# EAGLE design pixelAdapter_f103c8 (EAGLE 9.5.2)
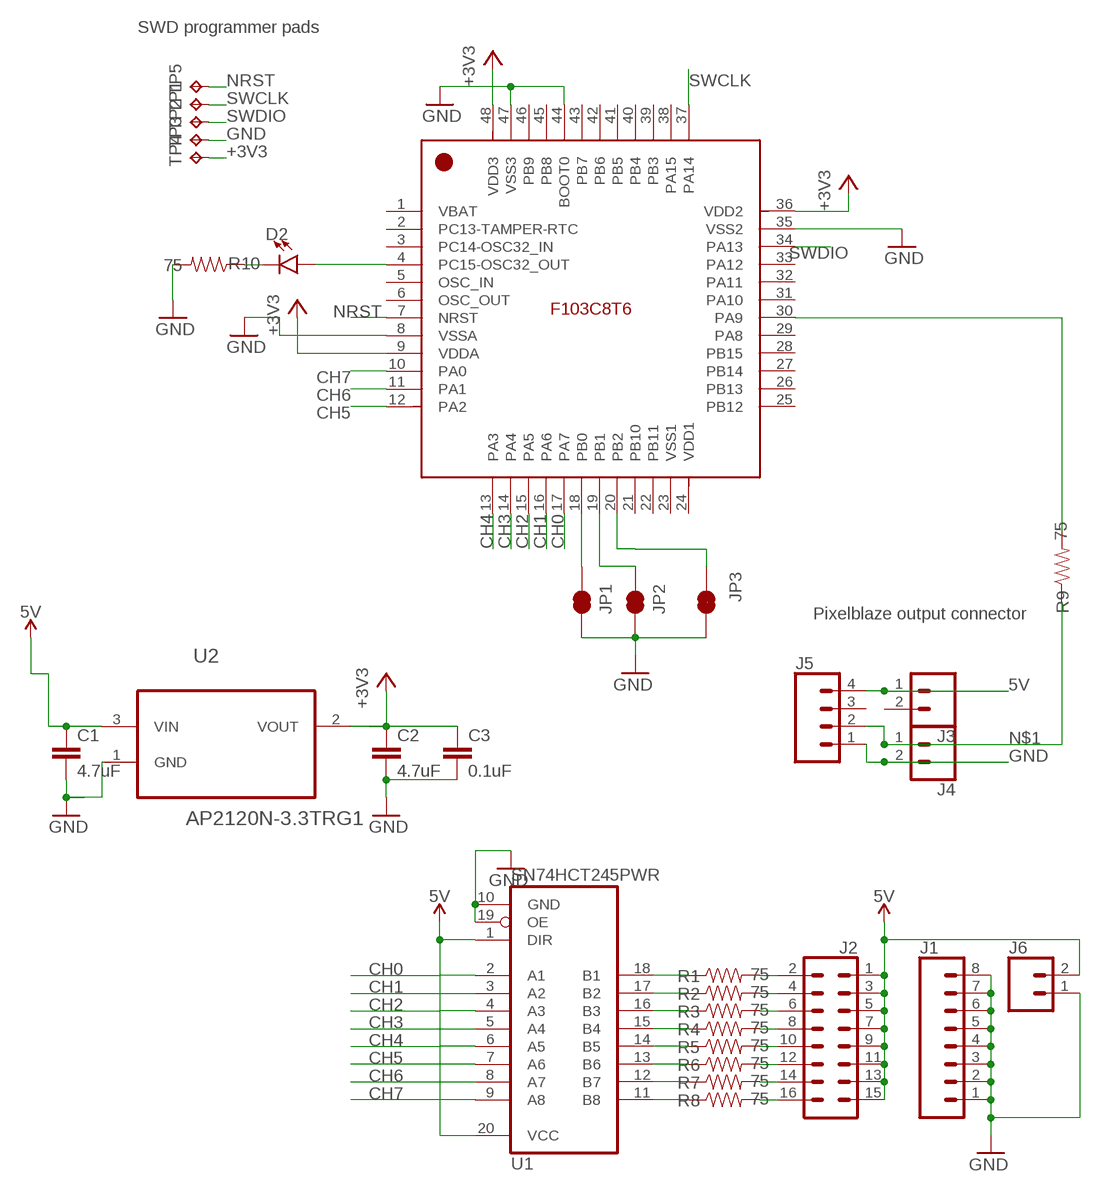
[diagram p0: schematic, sheet 1]

## Parts
C1  4.7uF  4.7UF0603  [0603]
C2  4.7uF  4.7UF0603  [0603]
C3  0.1uF  0.1UF-0603-25V-(+80/-20%)  [0603]
D2  LED0603  [LED-0603]
J1  CONN_08"  [1X08]
J2  CONN_08X2  [2X8]
J3  CONN_025MM  [SCREWTERMINAL-5MM-2]
J4  CONN_025MM  [SCREWTERMINAL-5MM-2]
J5  CONN_04LOCK  [1X04_LOCK]
J6  CONN_02  [1X02]
JP1  JUMPER-SMT_2_NC_TRACE_SILK  [SMT-JUMPER_2_NC_TRACE_SILK]
JP2  JUMPER-SMT_2_NC_TRACE_SILK  [SMT-JUMPER_2_NC_TRACE_SILK]
JP3  JUMPER-SMT_2_NC_TRACE_SILK  [SMT-JUMPER_2_NC_TRACE_SILK]
R1  75  100OHM-0603-1/4W-5%  [0603]
R2  75  100OHM-0603-1/4W-5%  [0603]
R3  75  100OHM-0603-1/4W-5%  [0603]
R4  75  100OHM-0603-1/4W-5%  [0603]
R5  75  100OHM-0603-1/4W-5%  [0603]
R6  75  100OHM-0603-1/4W-5%  [0603]
R7  75  100OHM-0603-1/4W-5%  [0603]
R8  75  100OHM-0603-1/4W-5%  [0603]
R9  75  100OHM-0603-1/4W-5%  [0603]
R10  75  100OHM-0603-1/4W-5%  [0603]
TP1  TPTP20SQ  [TP20SQ]
TP2  TPTP20SQ  [TP20SQ]
TP3  TPTP20SQ  [TP20SQ]
TP4  TPTP20SQ  [TP20SQ]
TP5  TPTP20SQ  [TP20SQ]
U1  SN74HCT245PWR  74245PW  [TSSOP20]
U2  AP2120N-3.3TRG1  MCP1700T-3302E/TT  [SOT95P237X112-3N]
U$1  STM32F103C8T6  [LQFP48_7X7MM_0.5MMPP]

## Nets
5V: C1.1 J2.1 J2.3 J2.5 J2.7 J2.9 J2.11 J2.13 J2.15 J3.1 J5.4 J6.2 U1.1(DIR) U1.20(VCC) U2.3(VIN)
+3V3: C2.1 C3.1 TP4.TP U2.2(VOUT) U$1.9(VDDA) U$1.36(VDD2) U$1.48(VDD3)
CH0: U1.2(A1) U$1.17(PA7)
CH1: U1.3(A2) U$1.16(PA6)
CH2: U1.4(A3) U$1.15(PA5)
CH3: U1.5(A4) U$1.14(PA4)
CH4: U1.6(A5) U$1.13(PA3)
CH5: U1.7(A6) U$1.12(PA2)
CH6: U1.8(A7) U$1.11(PA1)
CH7: U1.9(A8) U$1.10(PA0)
GND: C1.2 C2.2 C3.2 J1.1 J1.2 J1.3 J1.4 J1.5 J1.6 J1.7 J1.8 J4.2 J5.1 J6.1 JP1.2 JP2.2 JP3.1 R10.2 TP3.TP U1.10(GND) U1.19(OE) U2.1(GND) U$1.8(VSSA) U$1.35(VSS2) U$1.44(BOOT0) U$1.47(VSS3)
LED0: J2.2 R1.2
LED1: J2.4 R2.2
LED2: J2.6 R3.2
LED3: J2.8 R4.2
LED4: J2.10 R5.2
LED5: J2.12 R6.2
LED6: J2.14 R7.2
LED7: J2.16 R8.2
N$1: J4.1 J5.2 R9.1
N$2: JP1.1 U$1.18(PB0)
N$3: D2.A U$1.4(PC15-OSC32_OUT)
N$4: JP2.1 U$1.19(PB1)
N$5: JP3.2 U$1.20(PB2)
N$12: R1.1 U1.18(B1)
N$13: R2.1 U1.17(B2)
N$14: R3.1 U1.16(B3)
N$15: R4.1 U1.15(B4)
N$16: R5.1 U1.14(B5)
N$17: R6.1 U1.13(B6)
N$18: R7.1 U1.12(B7)
N$19: R8.1 U1.11(B8)
N$21: D2.C R10.1
NRST: TP5.TP U$1.7(NRST)
RX: R9.2 U$1.30(PA9)
SWCLK: TP1.TP U$1.37(PA14)
SWDIO: TP2.TP U$1.34(PA13)
Unconnected: J3.2 J5.3 U$1.1(VBAT) U$1.2(PC13-TAMPER-RTC) U$1.3(PC14-OSC32_IN) U$1.5(OSC_IN) U$1.6(OSC_OUT) U$1.21(PB10) U$1.22(PB11) U$1.23(VSS1) U$1.24(VDD1) U$1.25(PB12) U$1.26(PB13) U$1.27(PB14) U$1.28(PB15) U$1.29(PA8) U$1.31(PA10) U$1.32(PA11) U$1.33(PA12) U$1.38(PA15) U$1.39(PB3) U$1.40(PB4) U$1.41(PB5) U$1.42(PB6) U$1.43(PB7) U$1.45(PB8) U$1.46(PB9)

## Notes on the sheet
- SWD programmer pads
- Pixelblaze output connector

## Library data of the parts
C1 C2 = SparkFun-Capacitors:4.7UF: 4.7µF ceramic capacitors A capacitor is a passive two-terminal electrical component used to store electrical energy temporarily in an electric field.; PROD_ID: CAP-08280
C3 = SparkFun-Capacitors:0.1UF: 0.1µF ceramic capacitors A capacitor is a passive two-terminal electrical component used to store electrical energy temporarily in an electric field.; PROD_ID: CAP-00810
D2 = SparkFun-LED:LED: LED (Generic) Standard schematic elements and footprints for 5mm, 3mm, 1206, and 0603 sized LEDs. Generic LEDs with no color specified.
J1 = SparkFun-Connectors:CONN_08: Multi connection point. Often used as Generic Header-pin footprint for 0.1 inch spaced/style header connections On any of the 0.1 inch spaced packages, you can populate with these: Break Away Headers - Straight <https://www.sparkfun.com/products/116> (PRT-00116) Break Away Male Headers - Right Angle <https://www.sparkfun.com/products/553> (PRT-00553) Female Headers <https://www.sparkfun.com/products/115> (PRT-00115) Break Away Headers - Machine Pin <https://www.sparkfun.com/products/117> (PRT-00117) Break Away Female Headers - Swiss Machine Pin <https://www.sparkfun.com/products/743> (PRT-00743) Arduino Stackable Header - 8 Pin <https://www.sparkfun.com/products/9279> (PRT-09279) For SCREWTERMINALS and SPRING TERMINALS visit here: Screw Terimnals on SparkFun.com <https://www.sparkfun.com/search/results?term=Screw+Terminals> (5mm/3.5mm/2.54mm spacing) This device is also useful as a general connection point to wire up your design to another part of your project. Our various solder wires solder well into these plated through hole pads. Hook-Up Wire - Assortment (Stranded, 22 AWG) <https://www.sparkfun.com/products/11375> (PRT-11375) Hook-Up Wire - Assortment (Solid Core, 22 AWG) <https://www.sparkfun.com/products/11367> (PRT-11367) View the entire wire category on our website here <https://www.sparkfun.com/categories/141> Special notes: Molex polarized connector foot print use with SKU : PRT-08231 with associated crimp pins and housings. 1MM SMD Version SKU: PRT-10208 NOTES ON THE VARIANTS LOCK and LOCK_LONGPADS... This footprint was designed to help hold the alignment of a through-hole component (i.e. 6-pin header) while soldering it into place. You may notice that each hole has been shifted either up or down by 0.005 of an inch from it's more standard position (which is a perfectly straight line). This slight alteration caused the pins (the squares in the middle) to touch the edges of the holes. Because they are alternating, it causes a "brace" to hold the component in place. 0.005 has proven to be the perfect amount of "off-center" position when using our standard breakaway headers. Although looks a little odd when you look at the bare footprint, once you have a header in there, the alteration is very hard to notice. Also,if you push a header all the way into place, it is covered up entirely on the bottom side.; PROD_ID: CONN-08438
J2 = SparkFun-Connectors:CONN_08X2: Multi connection point. Often used as Generic Header-pin footprint for 0.1 inch spaced/style header connections You can populate with any combo of single row headers, but if you'd like an exact match, check this: Header - 2x8 (Male, 0.1") <https://www.sparkfun.com/products/13156> (PRT-13156) On any of the 0.1 inch spaced packages, you can populate with these: Break Away Headers - Straight <https://www.sparkfun.com/products/116> (PRT-00116) Break Away Male Headers - Right Angle <https://www.sparkfun.com/products/553> (PRT-00553) Female Headers <https://www.sparkfun.com/products/115> (PRT-00115) Break Away Headers - Machine Pin <https://www.sparkfun.com/products/117> (PRT-00117) Break Away Female Headers - Swiss Machine Pin <https://www.sparkfun.com/products/743> (PRT-00743)
J3 J4 = bens:CONN_02: Multi connection point. Often used as Generic Header-pin footprint for 0.1 inch spaced/style header connections On any of the 0.1 inch spaced packages, you can populate with these: Break Away Headers - Straight <https://www.sparkfun.com/products/116> (PRT-00116) Break Away Male Headers - Right Angle <https://www.sparkfun.com/products/553> (PRT-00553) Female Headers <https://www.sparkfun.com/products/115> (PRT-00115) Break Away Headers - Machine Pin <https://www.sparkfun.com/products/117> (PRT-00117) Break Away Female Headers - Swiss Machine Pin <https://www.sparkfun.com/products/743> (PRT-00743) For SCREWTERMINALS and SPRING TERMINALS visit here: Screw Terimnals on SparkFun.com <https://www.sparkfun.com/search/results?term=Screw+Terminals> (5mm/3.5mm/2.54mm spacing) This device is also useful as a general connection point to wire up your design to another part of your project. Our various solder wires solder well into these plated through hole pads. Hook-Up Wire - Assortment (Stranded, 22 AWG) <https://www.sparkfun.com/products/11375> (PRT-11375) Hook-Up Wire - Assortment (Solid Core, 22 AWG) <https://www.sparkfun.com/products/11367> (PRT-11367) View the entire wire category on our website here <https://www.sparkfun.com/categories/141> Special notes: Molex polarized connector foot print use with: PRT-08233 with associated crimp pins and housings. 2.54_SCREWTERM for use with PRT-10571. 3.5mm Screw Terminal footprints for PRT-08084 5mm Screw Terminal footprints for use with PRT-08432; SF_SKU: PRT-08432
J5 = SparkFun-Connectors:CONN_04: Multi connection point. Often used as Generic Header-pin footprint for 0.1 inch spaced/style header connections On any of the 0.1 inch spaced packages, you can populate with these: Break Away Headers - Straight <https://www.sparkfun.com/products/116> (PRT-00116) Break Away Male Headers - Right Angle <https://www.sparkfun.com/products/553> (PRT-00553) Female Headers <https://www.sparkfun.com/products/115> (PRT-00115) Break Away Headers - Machine Pin <https://www.sparkfun.com/products/117> (PRT-00117) Break Away Female Headers - Swiss Machine Pin <https://www.sparkfun.com/products/743> (PRT-00743) For SCREWTERMINALS and SPRING TERMINALS visit here: Screw Terimnals on SparkFun.com <https://www.sparkfun.com/search/results?term=Screw+Terminals> (5mm/3.5mm/2.54mm spacing) This device is also useful as a general connection point to wire up your design to another part of your project. Our various solder wires solder well into these plated through hole pads. Hook-Up Wire - Assortment (Stranded, 22 AWG) <https://www.sparkfun.com/products/11375> (PRT-11375) Hook-Up Wire - Assortment (Solid Core, 22 AWG) <https://www.sparkfun.com/products/11367> (PRT-11367) View the entire wire category on our website here <https://www.sparkfun.com/categories/141> Special notes: Molex polarized connector foot print use with SKU : PRT-08231 with associated crimp pins and housings. 1MM SMD Version SKU: PRT-10208; PROD_ID: CONN-09696
J6 = SparkFun-Connectors:CONN_02: Multi connection point. Often used as Generic Header-pin footprint for 0.1 inch spaced/style header connections On any of the 0.1 inch spaced packages, you can populate with these: Break Away Headers - Straight <https://www.sparkfun.com/products/116> (PRT-00116) Break Away Male Headers - Right Angle <https://www.sparkfun.com/products/553> (PRT-00553) Female Headers <https://www.sparkfun.com/products/115> (PRT-00115) Break Away Headers - Machine Pin <https://www.sparkfun.com/products/117> (PRT-00117) Break Away Female Headers - Swiss Machine Pin <https://www.sparkfun.com/products/743> (PRT-00743) For SCREWTERMINALS and SPRING TERMINALS visit here: Screw Terimnals on SparkFun.com <https://www.sparkfun.com/search/results?term=Screw+Terminals> (5mm/3.5mm/2.54mm spacing) This device is also useful as a general connection point to wire up your design to another part of your project. Our various solder wires solder well into these plated through hole pads. Hook-Up Wire - Assortment (Stranded, 22 AWG) <https://www.sparkfun.com/products/11375> (PRT-11375) Hook-Up Wire - Assortment (Solid Core, 22 AWG) <https://www.sparkfun.com/products/11367> (PRT-11367) View the entire wire category on our website here <https://www.sparkfun.com/categories/141> Special notes: Molex polarized connector foot print use with: PRT-08233 with associated crimp pins and housings. 2.54_SCREWTERM for use with PRT-10571. 3.5mm Screw Terminal footprints for PRT-08084 5mm Screw Terminal footprints for use with PRT-08432
JP1-JP3 = SparkFun-Jumpers:JUMPER-SMT_2_NC_TRACE: Normally closed trace jumper This jumper has a trace between two pads so it's normally closed (NC). Use a razor knife to open the connection. For best results follow the IPC guidelines for cutting traces: Cutout at least 0.063 mm (0.005 in). Remove all loose material to clean up the cut area. Seal the cut with an approved epoxy. Reapply solder to reclose the connection.
R1-R10 = SparkFun-Resistors:100OHM: 100Ω resistor A resistor is a passive two-terminal electrical component that implements electrical resistance as a circuit element. Resistors act to reduce current flow, and, at the same time, act to lower voltage levels within circuits. - Wikipedia; PROD_ID: RES-12438; VALUE: 100
TP1-TP5 = testpad:TP: Test pad
U1 = scanlime:74*245: Octal BUS TRANSCEIVER, 3-state
U2 = Microchip_By_element14_Batch_1:MCP1700T-3302E/TT: Low Quiescent Current LDO; MPN: MCP1700T-3302E/TT; OC_FARNELL: 1296592; OC_NEWARK: 88H9817; PACKAGE: SOT23-3; SUPPLIER: Microchip
U$1 = STM32F103C8T6:STM32F103C8T6; AVAILABILITY: Unavailable; DESCRIPTION: Mainstream Performance line, ARM Cortex-M3 MCU with 64 Kbytes Flash, 72 MHz CPU, motor control, USB and CAN; MF: STMicroelectronics; MP: STM32F103C8T6; PACKAGE: LQFP-48 STMicroelectronics; PRICE: None

## Board
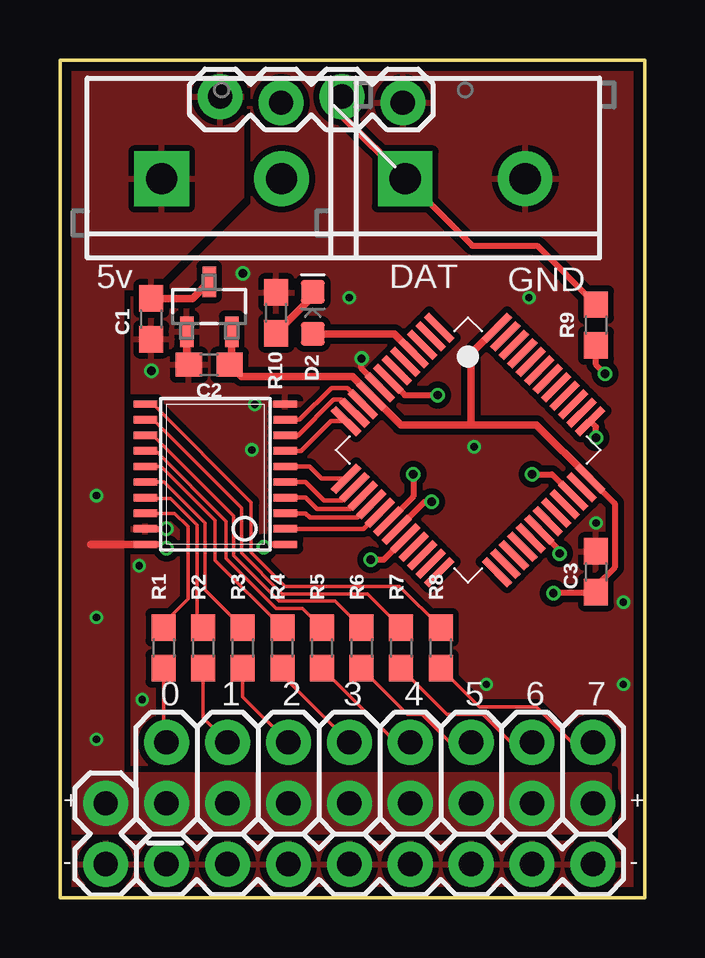
[diagram p1: board, top side]
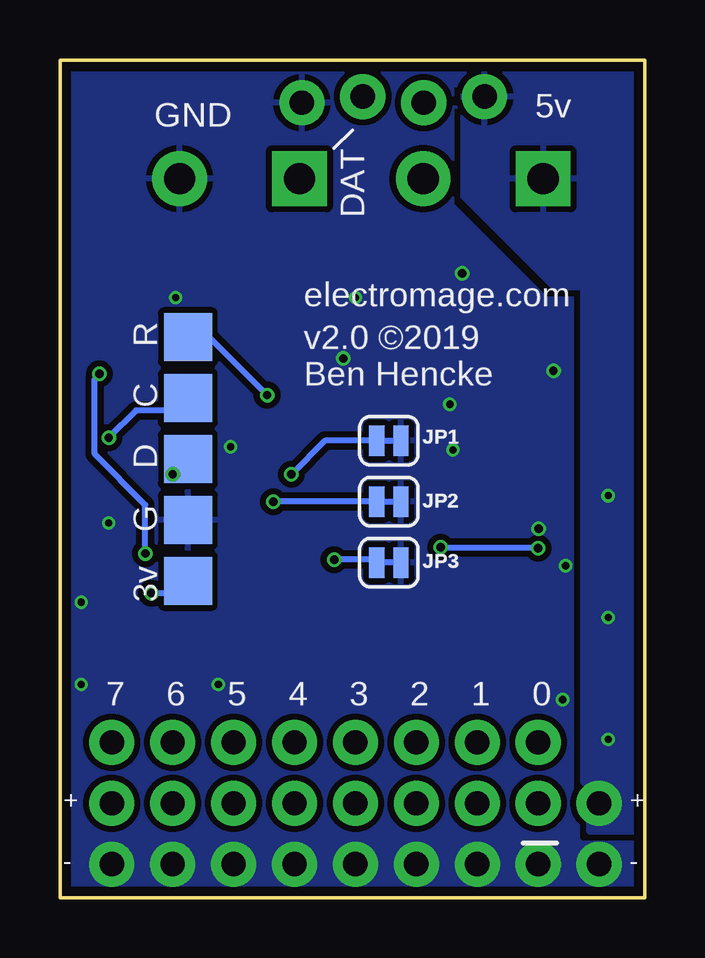
[diagram p2: board, bottom side, seen from below]

Size 24.38 x 34.92 mm. Coordinates in mm from the lower left corner, seen from the top.
Outline: 0,0 24.38,0 24.38,34.92 0,34.92 0,0
Copper layers (1*16): Top 0.035559375mm / dielectric 1.6mm / Bottom 0.035559375mm
Design rules "oshpark-2layer *": minimum track width 6mil, minimum drill 10mil, track to track 6mil, track to pad 6mil, pad to pad 6mil, via to via 6mil, smd to smd 6mil, copper to edge 15mil, drill to drill 6mil, minimum pad ring 5mil, minimum via ring 5mil, stop-mask expansion 1mil, vias tented up to drill 0mil, thermal gap 10mil

### Footprints (pad centres in the part's own frame; a part is rotated, then mirrored left to right if it is on the bottom)
0603 = smd 1.1 x 1: 1 -0.85,0; 2 0.85,0
LED-0603 = smd 1 x 1: A -0.877,0; C 0.877,0
1X08 = drill 1.016 pad 1.88: 1 0,0; 2 2.54,0; 3 5.08,0; 4 7.62,0; 5 10.16,0; 6 12.7,0; 7 15.24,0; 8 17.78,0
2X8 = drill 1.016 pad 1.88: 1 0,0; 2 0,2.54; 3 2.54,0; 4 2.54,2.54; 5 5.08,0; 6 5.08,2.54; 7 7.62,0; 8 7.62,2.54; 9 10.16,0; 10 10.16,2.54; 11 12.7,0; 12 12.7,2.54; 13 15.24,0; 14 15.24,2.54; 15 17.78,0; 16 17.78,2.54
SCREWTERMINAL-5MM-2 = drill 1.3 pad 2.286 square: 1 0,0 | drill 1.3 pad 2.286: 2 5,0
1X04_LOCK = drill 1.016 pad 1.88: 1 0,0.127; 2 2.54,-0.127; 3 5.08,0.127; 4 7.62,-0.127
1X02 = drill 1.016 pad 1.88: 1 0,0; 2 2.54,0
SMT-JUMPER_2_NC_TRACE_SILK = smd 0.635 x 1.27: 1 -0.508,0; 2 0.508,0
TP20SQ = smd 2 x 2: TP 0,0
TSSOP20 = smd 0.305 x 0.991: 1 -2.925,-2.918; 2 -2.275,-2.918; 3 -1.625,-2.918; 4 -0.975,-2.918; 5 -0.325,-2.918; 6 0.325,-2.918; 7 0.975,-2.918; 8 1.625,-2.918; 9 2.275,-2.918; 10 2.925,-2.918; 11 2.925,2.918; 12 2.275,2.918; 13 1.625,2.918; 14 0.975,2.918; 15 0.325,2.918; 16 -0.325,2.918; 17 -0.975,2.918; 18 -1.625,2.918; 19 -2.275,2.918; 20 -2.925,2.918
SOT95P237X112-3N = smd 0.559 x 1.27: 1 -0.94,-1.041; 2 0.94,-1.041; 3 0,1.041
LQFP48_7X7MM_0.5MMPP = smd 1.5 x 0.3: 1 -4.45,2.75; 2 -4.45,2.25; 3 -4.45,1.75; 4 -4.45,1.25; 5 -4.45,0.75; 6 -4.45,0.25; 7 -4.45,-0.25; 8 -4.45,-0.75; 9 -4.45,-1.25; 10 -4.45,-1.75; 11 -4.45,-2.25; 12 -4.45,-2.75; 25 4.45,-2.75; 26 4.45,-2.25; 27 4.45,-1.75; 28 4.45,-1.25; 29 4.45,-0.75; 30 4.45,-0.25; 31 4.45,0.25; 32 4.45,0.75; 33 4.45,1.25; 34 4.45,1.75; 35 4.45,2.25; 36 4.45,2.75 | smd 0.3 x 1.5: 13 -2.75,-4.45; 14 -2.25,-4.45; 15 -1.75,-4.45; 16 -1.25,-4.45; 17 -0.75,-4.45; 18 -0.25,-4.45; 19 0.25,-4.45; 20 0.75,-4.45; 21 1.25,-4.45; 22 1.75,-4.45; 23 2.25,-4.45; 24 2.75,-4.45; 37 2.75,4.45; 38 2.25,4.45; 39 1.75,4.45; 40 1.25,4.45; 41 0.75,4.45; 42 0.25,4.45; 43 -0.25,4.45; 44 -0.75,4.45; 45 -1.25,4.45; 46 -1.75,4.45; 47 -2.25,4.45; 48 -2.75,4.45

### Placement (x,y rotation side)
C1  3.81,24.13 270 top
C2  6.22,22.23 180 top
C3  22.35,13.59 90 top
D2  10.54,24.38 90 top
J1  4.45,1.4 0 top
J2  4.45,3.94 0 top
J3  4.24,29.97 0 top
J4  14.4,29.97 0 top
J5  14.3,33.27 180 top
J6  1.91,1.4 90 top
JP1  10.67,19.05 0 bottom
JP2  10.67,16.51 0 bottom
JP3  10.67,13.97 180 bottom
R1  4.32,10.41 270 top
R2  5.97,10.41 270 top
R3  7.62,10.41 270 top
R4  9.27,10.41 270 top
R5  10.92,10.41 270 top
R6  12.57,10.41 270 top
R7  14.22,10.41 270 top
R8  15.88,10.41 270 top
R9  22.35,23.88 270 top
R10  9.02,24.38 90 top
TP1  19.05,20.83 0 bottom
TP2  19.05,18.29 0 bottom
TP3  19.05,15.75 0 bottom
TP4  19.05,13.21 0 bottom
TP5  19.05,23.37 180 bottom
U1  6.48,17.65 90 top
U2  6.22,24.64 0 top
U$1  17.02,18.67 315 top

### Tracks (layer width: path | path; a pad name or v marks a point on that pad's centre or on a via)
5V  (via drill 0.3, 0.35)
  Top 0.254: U1.1 8.63,14.73 v8.51,14.61 | v4.45,14.57 4.29,14.73 U1.20
  Top 0.305: U1.20 1.27,14.73 | U2.3 5.52,24.98 C1.1
  Bottom 0.254: v8.51,14.61 4.48,14.61 v4.45,14.57
  other vias: 1.52,6.6 1.52,11.68 1.52,16.76
  pour Top (isolate 0.254, no thermals): 22.86,5.08 22.86,2.79 0,2.79 0,25.4 2.54,25.4 2.54,5.08
  pour Top (isolate 0.254): 7.62,34.8 7.62,29.21 3.81,25.4 0,25.4 0,34.8
  pour Bottom (isolate 0.254): 7.62,34.8 7.62,29.21 3.81,25.4 0,25.4 0,34.8
  pour Bottom (isolate 0.254, no thermals): 2.54,4.83 2.29,4.57 2.29,2.79 0,2.79 0,25.4 2.54,25.4
+3V3  (via drill 0.35)
  Top 0.254: U$1.36 23.13,16.45 23.13,13.77 22.35,12.99 C3.1 22.31,12.7 v20.57,12.7
  Top 0.305: U$1.36 | 17.14,19.71 14.21,19.71 U$1.9 12.2,21.72 7.58,21.72 C2.1 7.16,22.32 U2.2 | 17.14,19.71 19.87,19.71 U$1.36 | U$1.36 | U$1.48 17.14,22.68 17.14,19.71
  Bottom 0.254: 19.56,12.7 19.3,12.95 | 19.3,12.95 TP4.TP | v20.57,12.7 19.56,12.7 | 19.56,12.7 19.3,12.95
CH0
  Top 0.178: U1.2 12.67,15.38 U$1.17 | U$1.17
CH1
  Top 0.178: U$1.16 12.95,16.41 12.4,15.86 10.42,15.86 10.25,16.03 U1.3 | U$1.16
CH2
  Top 0.178: U$1.15 12.63,16.72 12.12,16.21 11.43,16.21 10.71,16.21 10.25,16.68 U1.4 | U$1.15
CH3
  Top 0.178: U$1.14 12.28,17.07 11.77,16.56 11.43,16.56 11.01,16.56 10.25,17.33 U1.5 | U$1.14
CH4
  Top 0.178: U1.6 10.4,17.98 10.91,17.47 U$1.13
CH5
  Top 0.178: U1.7 10.05,18.63 11.29,19.87 U$1.12
CH6
  Top 0.178: U$1.11 11.73,20.77 11.41,20.77 9.92,19.28 U1.8
CH7
  Top 0.178: U$1.10 12.63,20.62 12,21.25 11.32,21.25 9.99,19.93 U1.9
GND  (via drill 0.3, 0.35)
  Top 0.254: U$1.8 12.57,22.05 v12.57,22.48 | U1.19 v4.43,15.38
  Top 0.305: U2.1 5.28,22.32 C2.2
  other vias: 23.5,8.89 17.78,8.89 23.5,12.32 3.3,13.84 8.13,20.57 8,18.67 3.43,8.26 3.81,21.97 7.62,26.04 19.56,25.02 12.06,25.02 17.27,18.8 22.35,15.62
  pour Top (isolate 0.254, rank 6): 0,34.8 24.38,34.8 24.38,0 0,0
  pour Bottom (isolate 0.254, rank 6): 0,34.8 24.38,34.8 24.38,0 0,0
  pour Bottom (isolate 0.254, rank 6, no thermals): 0,2.54 24.13,2.54 24.13,0 0,0
LED0
  Top 0.152: R1.2 4.32,6.6 J2.2
LED1
  Top 0.152: R2.2 5.97,7.49 J2.4
LED2
  Top 0.152: R3.2 7.62,8.38 J2.6
LED3
  Top 0.152: R4.2 9.27,9.27 J2.8
LED4
  Top 0.152: R5.2 14.01,6.48 J2.10
LED5
  Top 0.152: R6.2 14.49,7.64 15.09,7.64 16.26,6.48 J2.12
LED6
  Top 0.152: R7.2 16.14,7.64 17.63,7.64 18.8,6.48 J2.14
LED7
  Top 0.152: R8.2 17.49,7.95 19.86,7.95 21.34,6.48 J2.16
N$1
  Top 0.254: J4.1 17.19,27.18 19.9,27.18 R9.1
  Top 0.305: J5.2 11.76,32.61 J4.1
N$2  (via drill 0.35)
  Top 0.254: v14.73,17.65 14.73,16.74 U$1.18
  Bottom 0.254: JP1.1 13.34,19.05 v14.73,17.65
N$3
  Top 0.305: U$1.4 13.95,23.51 D2.A
N$4  (via drill 0.35)
  Top 0.254: U$1.19 15.21,16.51 v15.49,16.51
  Bottom 0.254: JP2.1 v15.49,16.51
N$5  (via drill 0.35)
  Top 0.254: v12.95,14.1 13.51,14.1 U$1.20
  Bottom 0.254: JP3.2 11.3,14.1 v12.95,14.1
N$12
  Top 0.152: R1.1 4.32,11.43 5.35,12.46 5.35,15.47 4.79,16.03 U1.18
N$13
  Top 0.152: R2.1 5.71,11.52 5.71,15.53 4.61,16.64 3.6,16.64 U1.17
N$14
  Top 0.152: R3.1 6.04,12.84 6.04,15.63 4.35,17.33 U1.16
N$15
  Top 0.152: R4.1 6.48,14.06 6.48,15.72 4.22,17.98 U1.15
N$16
  Top 0.152: R5.1 10.12,12.06 9.01,12.06 6.93,14.14 6.93,15.7 4,18.63 U1.14
N$17
  Top 0.152: R6.1 11.47,12.37 9.13,12.37 7.24,14.26 7.24,15.92 3.88,19.28 U1.13
N$18
  Top 0.152: R7.1 12.81,12.68 9.26,12.68 7.57,14.36 7.57,16.24 3.88,19.93 U1.12
N$19
  Top 0.152: R8.1 14.16,12.98 9.38,12.98 7.98,14.38 7.98,16.48 3.88,20.58 U1.11
N$21
  Top 0.305: R10.1 10.54,25.06 D2.C
NRST  (via drill 0.35)
  Top 0.254: U$1.7 14.38,20.95 v15.75,20.95
  Bottom 0.254: v15.75,20.95 18.16,23.37 TP5.TP
RX  (via drill 0.35)
  Top 0.254: U$1.30 20.83,14.51 v20.83,14.35 | v22.73,21.84 22.35,22.23 R9.2
  Bottom 0.254: v20.83,14.35 20.83,16.38 22.93,18.49 22.93,21.64 v22.73,21.84
SWCLK  (via drill 0.35)
  Top 0.254: v22.35,19.18 22.35,19.63 U$1.37
  Bottom 0.254: TP1.TP 19.56,20.32 21.21,20.32 v22.35,19.18
SWDIO  (via drill 0.35)
  Top 0.254: v19.68,17.65 20.51,17.65 U$1.34
  Bottom 0.254: TP2.TP v19.68,17.65

### Text on the board
_tNames: 5v | DAT | GND | C1 | R9 | R10 | D2 | C2 | R1 | R2 | R3 | R4 | R5 | R6 | R7 | R8 | C3 | 0 | 1 | 2 | 3 | 4 | 5 | 6 | 7 | + | + | - | -
_bNames: 5v | GND | DAT | electromage.com | R | v2.0 ©2019 / Ben Hencke | C | JP1 | D | JP2 | G | JP3 | 3v | 0 | 1 | 2 | 3 | 4 | 5 | 6 | 7 | + | + | - | -